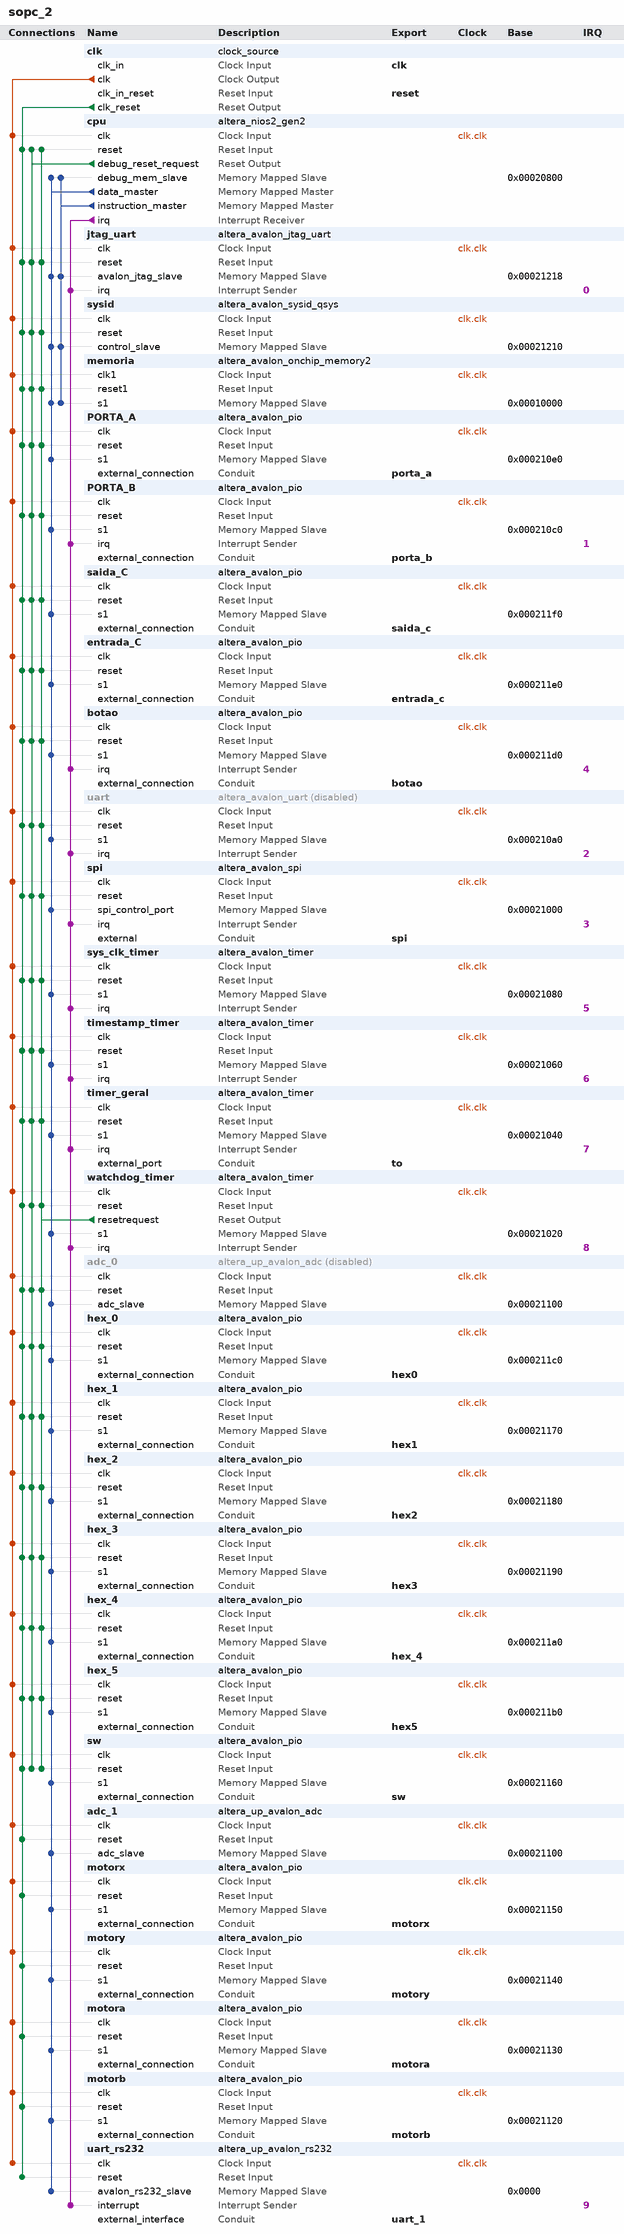
[diagram p0: system contents]
# Platform Designer (Qsys) system sopc_2, MAX 10 10M50DAF484C7G
# Parameters at their usual value, and those the tool derives, are not listed.
package require -exact qsys 17.0
create_system sopc_2
set_project_property DEVICE_FAMILY {MAX 10}
set_project_property DEVICE 10M50DAF484C7G

add_instance clk clock_source 17.0
set_instance_parameter_value clk clockFrequency 50000000
set_instance_parameter_value clk resetSynchronousEdges BOTH

add_instance cpu altera_nios2_gen2 17.0
set_instance_parameter_value cpu dcache_size 2048
set_instance_parameter_value cpu exceptionSlave memoria.s1
set_instance_parameter_value cpu icache_size 4096
set_instance_parameter_value cpu impl Tiny
set_instance_parameter_value cpu resetSlave memoria.s1
set_instance_parameter_value cpu setting_activateTrace true

add_instance jtag_uart altera_avalon_jtag_uart 17.0
set_instance_parameter_value jtag_uart simInteractiveOptions NO_INTERACTIVE_WINDOWS

add_instance sysid altera_avalon_sysid_qsys 17.0
set_instance_parameter_value sysid id 242

add_instance memoria altera_avalon_onchip_memory2 17.0
set_instance_parameter_value memoria dataWidth 32
set_instance_parameter_value memoria dualPort false
set_instance_parameter_value memoria initMemContent true
set_instance_parameter_value memoria initializationFileName onchip_mem.hex
set_instance_parameter_value memoria memorySize 50000

add_instance PORTA_A altera_avalon_pio 17.0
set_instance_parameter_value PORTA_A bitModifyingOutReg true
set_instance_parameter_value PORTA_A captureEdge true
set_instance_parameter_value PORTA_A direction Bidir
set_instance_parameter_value PORTA_A simDoTestBenchWiring true
set_instance_parameter_value PORTA_A width 8

add_instance PORTA_B altera_avalon_pio 17.0
set_instance_parameter_value PORTA_B bitModifyingOutReg true
set_instance_parameter_value PORTA_B captureEdge true
set_instance_parameter_value PORTA_B direction Bidir
set_instance_parameter_value PORTA_B generateIRQ true
set_instance_parameter_value PORTA_B simDoTestBenchWiring true
set_instance_parameter_value PORTA_B width 8

add_instance saida_C altera_avalon_pio 17.0
set_instance_parameter_value saida_C direction Output
set_instance_parameter_value saida_C width 8

add_instance entrada_C altera_avalon_pio 17.0
set_instance_parameter_value entrada_C direction Input
set_instance_parameter_value entrada_C simDoTestBenchWiring true
set_instance_parameter_value entrada_C width 8

add_instance botao altera_avalon_pio 17.0
set_instance_parameter_value botao captureEdge true
set_instance_parameter_value botao direction Input
set_instance_parameter_value botao generateIRQ true
set_instance_parameter_value botao irqType EDGE
set_instance_parameter_value botao simDoTestBenchWiring true
set_instance_parameter_value botao width 1

add_instance uart altera_avalon_uart 17.0
set_instance_property uart ENABLED false
set_instance_parameter_value uart baud 9600
set_instance_parameter_value uart dataBits 8
set_instance_parameter_value uart fixedBaud true
set_instance_parameter_value uart parity NONE
set_instance_parameter_value uart stopBits 1

add_instance spi altera_avalon_spi 17.0
set_instance_parameter_value spi clockPolarity 0
set_instance_parameter_value spi dataWidth 8
set_instance_parameter_value spi lsbOrderedFirst true
set_instance_parameter_value spi masterSPI true
set_instance_parameter_value spi numberOfSlaves 2
set_instance_parameter_value spi targetClockRate 128000

add_instance sys_clk_timer altera_avalon_timer 17.0
set_instance_parameter_value sys_clk_timer alwaysRun true
set_instance_parameter_value sys_clk_timer period 1
set_instance_parameter_value sys_clk_timer periodUnits MSEC

add_instance timestamp_timer altera_avalon_timer 17.0
set_instance_parameter_value timestamp_timer period 1
set_instance_parameter_value timestamp_timer periodUnits MSEC

add_instance timer_geral altera_avalon_timer 17.0
set_instance_parameter_value timer_geral period 1
set_instance_parameter_value timer_geral periodUnits MSEC
set_instance_parameter_value timer_geral timeoutPulseOutput true

add_instance watchdog_timer altera_avalon_timer 17.0
set_instance_parameter_value watchdog_timer alwaysRun true
set_instance_parameter_value watchdog_timer fixedPeriod true
set_instance_parameter_value watchdog_timer period 100
set_instance_parameter_value watchdog_timer periodUnits MSEC
set_instance_parameter_value watchdog_timer resetOutput true
set_instance_parameter_value watchdog_timer snapshot false

add_instance adc_0 altera_up_avalon_adc 17.0
set_instance_property adc_0 ENABLED false
set_instance_parameter_value adc_0 board DE10-Lite
set_instance_parameter_value adc_0 numch_ 6
set_instance_parameter_value adc_0 sclk_freq 10.0

add_instance hex_0 altera_avalon_pio 17.0
set_instance_parameter_value hex_0 direction Output
set_instance_parameter_value hex_0 resetValue 255
set_instance_parameter_value hex_0 width 8

add_instance hex_1 altera_avalon_pio 17.0
set_instance_parameter_value hex_1 direction Output
set_instance_parameter_value hex_1 resetValue 255
set_instance_parameter_value hex_1 width 8

add_instance hex_2 altera_avalon_pio 17.0
set_instance_parameter_value hex_2 direction Output
set_instance_parameter_value hex_2 resetValue 255
set_instance_parameter_value hex_2 width 8

add_instance hex_3 altera_avalon_pio 17.0
set_instance_parameter_value hex_3 direction Output
set_instance_parameter_value hex_3 resetValue 255
set_instance_parameter_value hex_3 width 8

add_instance hex_4 altera_avalon_pio 17.0
set_instance_parameter_value hex_4 direction Output
set_instance_parameter_value hex_4 resetValue 255
set_instance_parameter_value hex_4 width 8

add_instance hex_5 altera_avalon_pio 17.0
set_instance_parameter_value hex_5 direction Output
set_instance_parameter_value hex_5 resetValue 255
set_instance_parameter_value hex_5 width 8

add_instance sw altera_avalon_pio 17.0
set_instance_parameter_value sw direction Input
set_instance_parameter_value sw simDoTestBenchWiring true
set_instance_parameter_value sw width 10

add_instance adc_1 altera_up_avalon_adc 17.0
set_instance_parameter_value adc_1 board DE10-Lite
set_instance_parameter_value adc_1 numch_ 6
set_instance_parameter_value adc_1 sclk_freq 10.0

add_instance motorx altera_avalon_pio 17.0
set_instance_parameter_value motorx direction Output
set_instance_parameter_value motorx width 16

add_instance motory altera_avalon_pio 17.0
set_instance_parameter_value motory direction Output
set_instance_parameter_value motory width 16

add_instance motora altera_avalon_pio 17.0
set_instance_parameter_value motora direction Output
set_instance_parameter_value motora width 16

add_instance motorb altera_avalon_pio 17.0
set_instance_parameter_value motorb direction Output
set_instance_parameter_value motorb width 16

add_instance uart_rs232 altera_up_avalon_rs232 17.0
set_instance_parameter_value uart_rs232 baud 9600
set_instance_parameter_value uart_rs232 parity None

# connections
add_connection clk.clk adc_0.clk clock
add_connection clk.clk adc_1.clk clock
add_connection clk.clk botao.clk clock
add_connection clk.clk cpu.clk clock
add_connection clk.clk entrada_C.clk clock
add_connection clk.clk hex_0.clk clock
add_connection clk.clk hex_1.clk clock
add_connection clk.clk hex_2.clk clock
add_connection clk.clk hex_3.clk clock
add_connection clk.clk hex_4.clk clock
add_connection clk.clk hex_5.clk clock
add_connection clk.clk jtag_uart.clk clock
add_connection clk.clk memoria.clk1 clock
add_connection clk.clk motora.clk clock
add_connection clk.clk motorb.clk clock
add_connection clk.clk motorx.clk clock
add_connection clk.clk motory.clk clock
add_connection clk.clk PORTA_A.clk clock
add_connection clk.clk PORTA_B.clk clock
add_connection clk.clk saida_C.clk clock
add_connection clk.clk spi.clk clock
add_connection clk.clk sw.clk clock
add_connection clk.clk sys_clk_timer.clk clock
add_connection clk.clk sysid.clk clock
add_connection clk.clk timer_geral.clk clock
add_connection clk.clk timestamp_timer.clk clock
add_connection clk.clk uart.clk clock
add_connection clk.clk uart_rs232.clk clock
add_connection clk.clk watchdog_timer.clk clock
add_connection clk.clk_reset adc_0.reset reset
add_connection clk.clk_reset adc_1.reset reset
add_connection clk.clk_reset botao.reset reset
add_connection clk.clk_reset cpu.reset reset
add_connection clk.clk_reset entrada_C.reset reset
add_connection clk.clk_reset hex_0.reset reset
add_connection clk.clk_reset hex_1.reset reset
add_connection clk.clk_reset hex_2.reset reset
add_connection clk.clk_reset hex_3.reset reset
add_connection clk.clk_reset hex_4.reset reset
add_connection clk.clk_reset hex_5.reset reset
add_connection clk.clk_reset jtag_uart.reset reset
add_connection clk.clk_reset memoria.reset1 reset
add_connection clk.clk_reset motora.reset reset
add_connection clk.clk_reset motorb.reset reset
add_connection clk.clk_reset motorx.reset reset
add_connection clk.clk_reset motory.reset reset
add_connection clk.clk_reset PORTA_A.reset reset
add_connection clk.clk_reset PORTA_B.reset reset
add_connection clk.clk_reset saida_C.reset reset
add_connection clk.clk_reset spi.reset reset
add_connection clk.clk_reset sw.reset reset
add_connection clk.clk_reset sys_clk_timer.reset reset
add_connection clk.clk_reset sysid.reset reset
add_connection clk.clk_reset timer_geral.reset reset
add_connection clk.clk_reset timestamp_timer.reset reset
add_connection clk.clk_reset uart.reset reset
add_connection clk.clk_reset uart_rs232.reset reset
add_connection clk.clk_reset watchdog_timer.reset reset
add_connection cpu.debug_reset_request adc_0.reset reset
add_connection cpu.debug_reset_request botao.reset reset
add_connection cpu.debug_reset_request cpu.reset reset
add_connection cpu.debug_reset_request entrada_C.reset reset
add_connection cpu.debug_reset_request hex_0.reset reset
add_connection cpu.debug_reset_request hex_1.reset reset
add_connection cpu.debug_reset_request hex_2.reset reset
add_connection cpu.debug_reset_request hex_3.reset reset
add_connection cpu.debug_reset_request hex_4.reset reset
add_connection cpu.debug_reset_request hex_5.reset reset
add_connection cpu.debug_reset_request jtag_uart.reset reset
add_connection cpu.debug_reset_request memoria.reset1 reset
add_connection cpu.debug_reset_request PORTA_A.reset reset
add_connection cpu.debug_reset_request PORTA_B.reset reset
add_connection cpu.debug_reset_request saida_C.reset reset
add_connection cpu.debug_reset_request spi.reset reset
add_connection cpu.debug_reset_request sw.reset reset
add_connection cpu.debug_reset_request sys_clk_timer.reset reset
add_connection cpu.debug_reset_request sysid.reset reset
add_connection cpu.debug_reset_request timer_geral.reset reset
add_connection cpu.debug_reset_request timestamp_timer.reset reset
add_connection cpu.debug_reset_request uart.reset reset
add_connection cpu.debug_reset_request watchdog_timer.reset reset
add_connection watchdog_timer.resetrequest adc_0.reset reset
add_connection watchdog_timer.resetrequest botao.reset reset
add_connection watchdog_timer.resetrequest cpu.reset reset
add_connection watchdog_timer.resetrequest entrada_C.reset reset
add_connection watchdog_timer.resetrequest hex_0.reset reset
add_connection watchdog_timer.resetrequest hex_1.reset reset
add_connection watchdog_timer.resetrequest hex_2.reset reset
add_connection watchdog_timer.resetrequest hex_3.reset reset
add_connection watchdog_timer.resetrequest hex_4.reset reset
add_connection watchdog_timer.resetrequest hex_5.reset reset
add_connection watchdog_timer.resetrequest jtag_uart.reset reset
add_connection watchdog_timer.resetrequest memoria.reset1 reset
add_connection watchdog_timer.resetrequest PORTA_A.reset reset
add_connection watchdog_timer.resetrequest PORTA_B.reset reset
add_connection watchdog_timer.resetrequest saida_C.reset reset
add_connection watchdog_timer.resetrequest spi.reset reset
add_connection watchdog_timer.resetrequest sw.reset reset
add_connection watchdog_timer.resetrequest sys_clk_timer.reset reset
add_connection watchdog_timer.resetrequest sysid.reset reset
add_connection watchdog_timer.resetrequest timer_geral.reset reset
add_connection watchdog_timer.resetrequest timestamp_timer.reset reset
add_connection watchdog_timer.resetrequest uart.reset reset
add_connection watchdog_timer.resetrequest watchdog_timer.reset reset
add_connection cpu.data_master adc_0.adc_slave avalon
set_connection_parameter_value cpu.data_master/adc_0.adc_slave baseAddress 0x00021100
add_connection cpu.data_master adc_1.adc_slave avalon
set_connection_parameter_value cpu.data_master/adc_1.adc_slave baseAddress 0x00021100
add_connection cpu.data_master botao.s1 avalon
set_connection_parameter_value cpu.data_master/botao.s1 baseAddress 0x000211d0
add_connection cpu.data_master cpu.debug_mem_slave avalon
set_connection_parameter_value cpu.data_master/cpu.debug_mem_slave baseAddress 0x00020800
add_connection cpu.data_master entrada_C.s1 avalon
set_connection_parameter_value cpu.data_master/entrada_C.s1 baseAddress 0x000211e0
add_connection cpu.data_master hex_0.s1 avalon
set_connection_parameter_value cpu.data_master/hex_0.s1 baseAddress 0x000211c0
add_connection cpu.data_master hex_1.s1 avalon
set_connection_parameter_value cpu.data_master/hex_1.s1 baseAddress 0x00021170
add_connection cpu.data_master hex_2.s1 avalon
set_connection_parameter_value cpu.data_master/hex_2.s1 baseAddress 0x00021180
add_connection cpu.data_master hex_3.s1 avalon
set_connection_parameter_value cpu.data_master/hex_3.s1 baseAddress 0x00021190
add_connection cpu.data_master hex_4.s1 avalon
set_connection_parameter_value cpu.data_master/hex_4.s1 baseAddress 0x000211a0
add_connection cpu.data_master hex_5.s1 avalon
set_connection_parameter_value cpu.data_master/hex_5.s1 baseAddress 0x000211b0
add_connection cpu.data_master jtag_uart.avalon_jtag_slave avalon
set_connection_parameter_value cpu.data_master/jtag_uart.avalon_jtag_slave baseAddress 0x00021218
add_connection cpu.data_master memoria.s1 avalon
set_connection_parameter_value cpu.data_master/memoria.s1 baseAddress 0x00010000
add_connection cpu.data_master motora.s1 avalon
set_connection_parameter_value cpu.data_master/motora.s1 baseAddress 0x00021130
add_connection cpu.data_master motorb.s1 avalon
set_connection_parameter_value cpu.data_master/motorb.s1 baseAddress 0x00021120
add_connection cpu.data_master motorx.s1 avalon
set_connection_parameter_value cpu.data_master/motorx.s1 baseAddress 0x00021150
add_connection cpu.data_master motory.s1 avalon
set_connection_parameter_value cpu.data_master/motory.s1 baseAddress 0x00021140
add_connection cpu.data_master PORTA_A.s1 avalon
set_connection_parameter_value cpu.data_master/PORTA_A.s1 baseAddress 0x000210e0
add_connection cpu.data_master PORTA_B.s1 avalon
set_connection_parameter_value cpu.data_master/PORTA_B.s1 baseAddress 0x000210c0
add_connection cpu.data_master saida_C.s1 avalon
set_connection_parameter_value cpu.data_master/saida_C.s1 baseAddress 0x000211f0
add_connection cpu.data_master spi.spi_control_port avalon
set_connection_parameter_value cpu.data_master/spi.spi_control_port baseAddress 0x00021000
add_connection cpu.data_master sw.s1 avalon
set_connection_parameter_value cpu.data_master/sw.s1 baseAddress 0x00021160
add_connection cpu.data_master sys_clk_timer.s1 avalon
set_connection_parameter_value cpu.data_master/sys_clk_timer.s1 baseAddress 0x00021080
add_connection cpu.data_master sysid.control_slave avalon
set_connection_parameter_value cpu.data_master/sysid.control_slave baseAddress 0x00021210
add_connection cpu.data_master timer_geral.s1 avalon
set_connection_parameter_value cpu.data_master/timer_geral.s1 baseAddress 0x00021040
add_connection cpu.data_master timestamp_timer.s1 avalon
set_connection_parameter_value cpu.data_master/timestamp_timer.s1 baseAddress 0x00021060
add_connection cpu.data_master uart.s1 avalon
set_connection_parameter_value cpu.data_master/uart.s1 baseAddress 0x000210a0
add_connection cpu.data_master uart_rs232.avalon_rs232_slave avalon
set_connection_parameter_value cpu.data_master/uart_rs232.avalon_rs232_slave baseAddress 0x0000
add_connection cpu.data_master watchdog_timer.s1 avalon
set_connection_parameter_value cpu.data_master/watchdog_timer.s1 baseAddress 0x00021020
add_connection cpu.instruction_master cpu.debug_mem_slave avalon
set_connection_parameter_value cpu.instruction_master/cpu.debug_mem_slave baseAddress 0x00020800
add_connection cpu.instruction_master jtag_uart.avalon_jtag_slave avalon
set_connection_parameter_value cpu.instruction_master/jtag_uart.avalon_jtag_slave baseAddress 0x00021218
add_connection cpu.instruction_master memoria.s1 avalon
set_connection_parameter_value cpu.instruction_master/memoria.s1 baseAddress 0x00010000
add_connection cpu.instruction_master sysid.control_slave avalon
set_connection_parameter_value cpu.instruction_master/sysid.control_slave baseAddress 0x00021210
add_connection cpu.irq botao.irq interrupt
set_connection_parameter_value cpu.irq/botao.irq irqNumber 4
add_connection cpu.irq jtag_uart.irq interrupt
set_connection_parameter_value cpu.irq/jtag_uart.irq irqNumber 0
add_connection cpu.irq PORTA_B.irq interrupt
set_connection_parameter_value cpu.irq/PORTA_B.irq irqNumber 1
add_connection cpu.irq spi.irq interrupt
set_connection_parameter_value cpu.irq/spi.irq irqNumber 3
add_connection cpu.irq sys_clk_timer.irq interrupt
set_connection_parameter_value cpu.irq/sys_clk_timer.irq irqNumber 5
add_connection cpu.irq timer_geral.irq interrupt
set_connection_parameter_value cpu.irq/timer_geral.irq irqNumber 7
add_connection cpu.irq timestamp_timer.irq interrupt
set_connection_parameter_value cpu.irq/timestamp_timer.irq irqNumber 6
add_connection cpu.irq uart.irq interrupt
set_connection_parameter_value cpu.irq/uart.irq irqNumber 2
add_connection cpu.irq uart_rs232.interrupt interrupt
set_connection_parameter_value cpu.irq/uart_rs232.interrupt irqNumber 9
add_connection cpu.irq watchdog_timer.irq interrupt
set_connection_parameter_value cpu.irq/watchdog_timer.irq irqNumber 8

# exported interfaces
add_interface botao conduit end
set_interface_property botao EXPORT_OF botao.external_connection
add_interface clk clock sink
set_interface_property clk EXPORT_OF clk.clk_in
add_interface entrada_c conduit end
set_interface_property entrada_c EXPORT_OF entrada_C.external_connection
add_interface hex0 conduit end
set_interface_property hex0 EXPORT_OF hex_0.external_connection
add_interface hex1 conduit end
set_interface_property hex1 EXPORT_OF hex_1.external_connection
add_interface hex2 conduit end
set_interface_property hex2 EXPORT_OF hex_2.external_connection
add_interface hex3 conduit end
set_interface_property hex3 EXPORT_OF hex_3.external_connection
add_interface hex5 conduit end
set_interface_property hex5 EXPORT_OF hex_5.external_connection
add_interface hex_4 conduit end
set_interface_property hex_4 EXPORT_OF hex_4.external_connection
add_interface motora conduit end
set_interface_property motora EXPORT_OF motora.external_connection
add_interface motorb conduit end
set_interface_property motorb EXPORT_OF motorb.external_connection
add_interface motorx conduit end
set_interface_property motorx EXPORT_OF motorx.external_connection
add_interface motory conduit end
set_interface_property motory EXPORT_OF motory.external_connection
add_interface porta_a conduit end
set_interface_property porta_a EXPORT_OF PORTA_A.external_connection
add_interface porta_b conduit end
set_interface_property porta_b EXPORT_OF PORTA_B.external_connection
add_interface reset reset sink
set_interface_property reset EXPORT_OF clk.clk_in_reset
add_interface saida_c conduit end
set_interface_property saida_c EXPORT_OF saida_C.external_connection
add_interface spi conduit end
set_interface_property spi EXPORT_OF spi.external
add_interface sw conduit end
set_interface_property sw EXPORT_OF sw.external_connection
add_interface to conduit end
set_interface_property to EXPORT_OF timer_geral.external_port
add_interface uart_1 conduit end
set_interface_property uart_1 EXPORT_OF uart_rs232.external_interface

set_interconnect_requirement {$system} qsys_mm.clockCrossingAdapter HANDSHAKE
set_interconnect_requirement {$system} qsys_mm.insertDefaultSlave false
set_interconnect_requirement {$system} qsys_mm.maxAdditionalLatency 1

save_system sopc_2.qsys
